# EAGLE design mmu610_v1.0b (EAGLE 4.15)
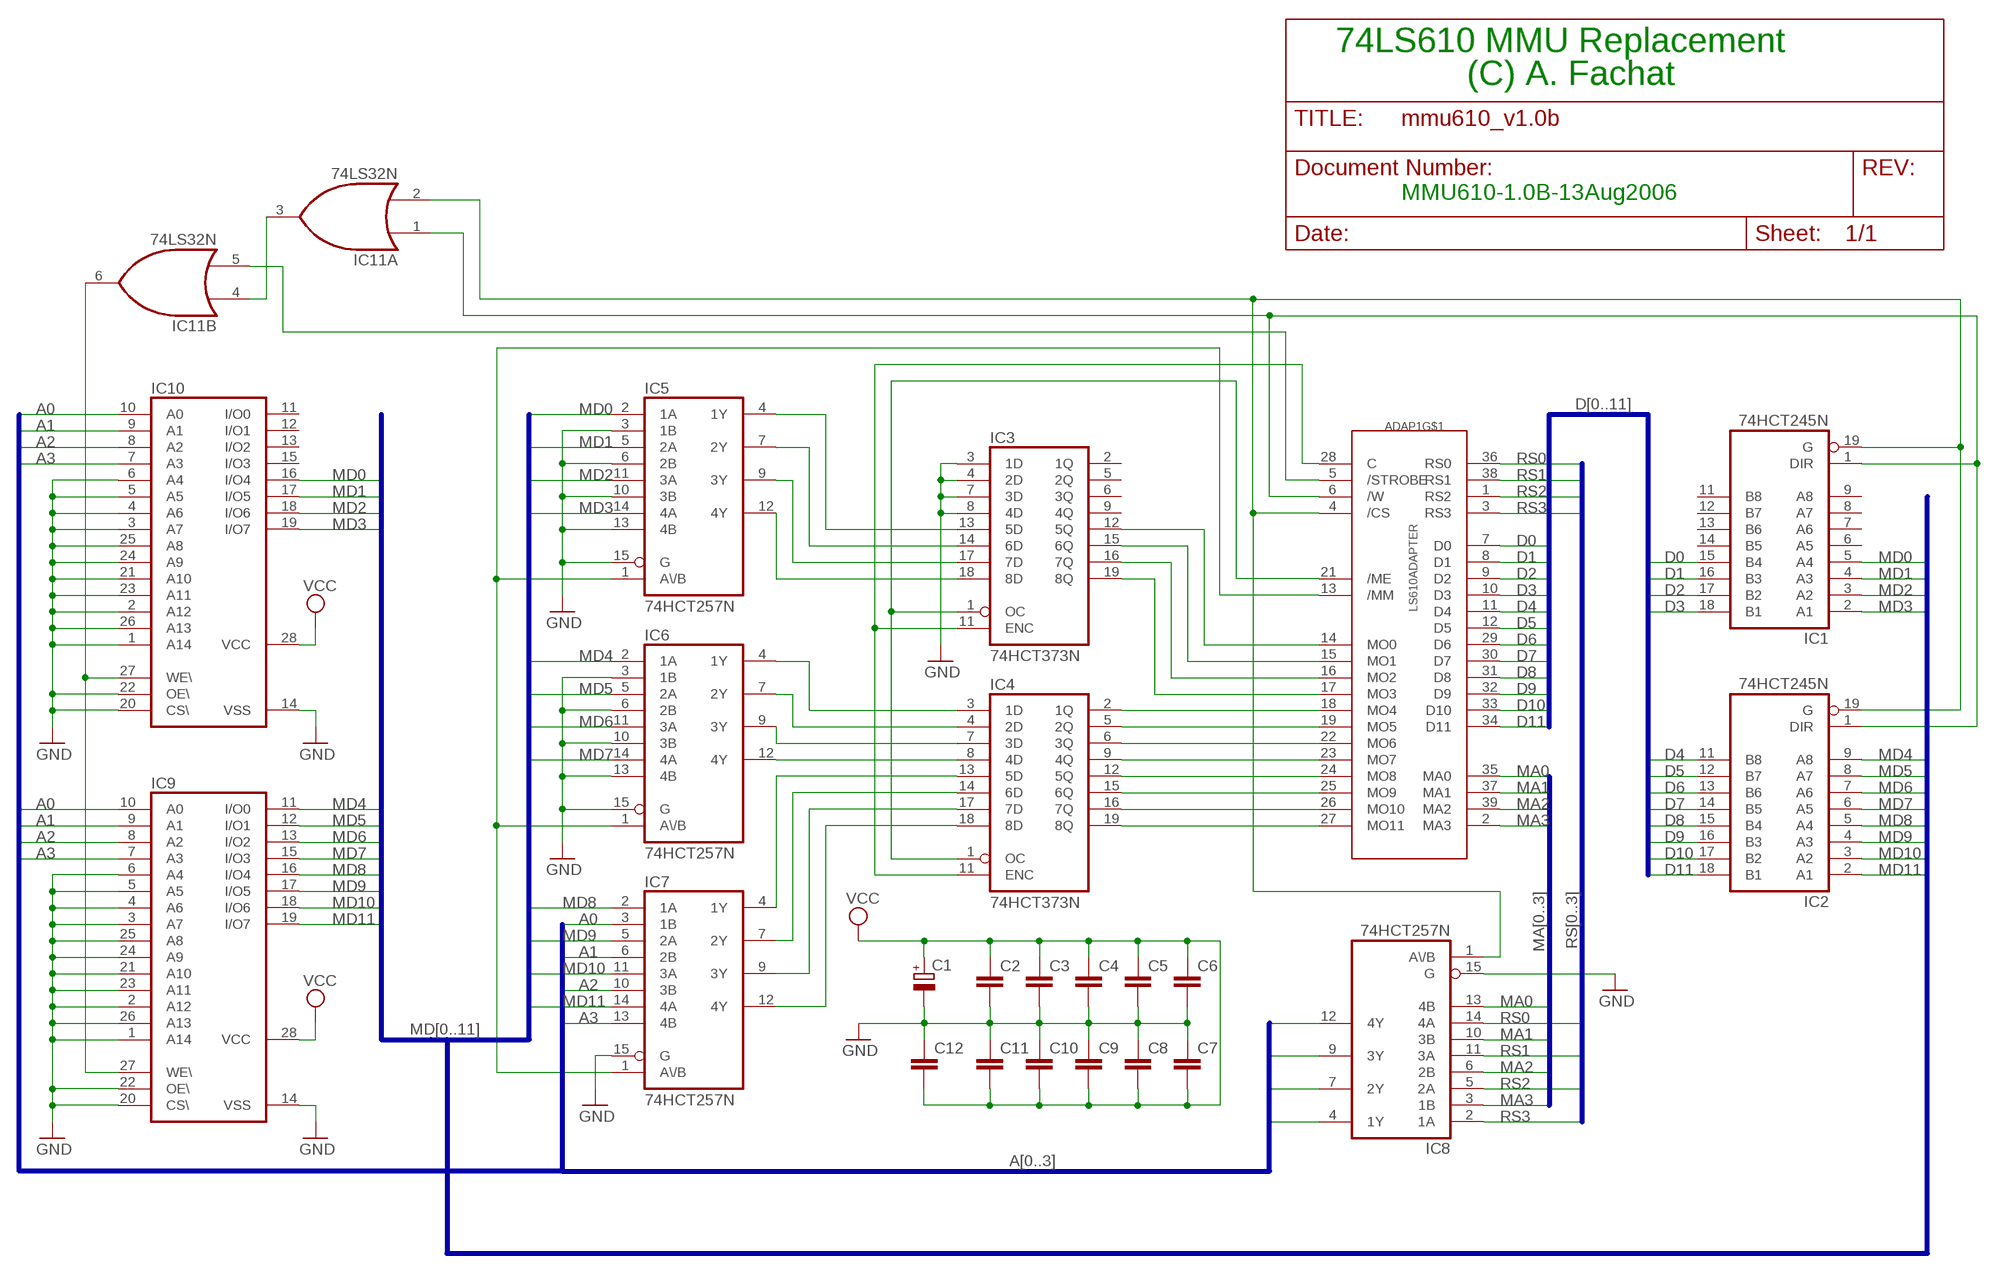
[diagram p0: schematic, sheet 1]

## Parts
ADAP1  LS610ADAPTER  [DIL40]
C1  CPOL-EUE2.5-6  [E2,5-6]
C2  C-EU025-025X050  [C025-025X050]
C3  C-EU025-025X050  [C025-025X050]
C4  C-EU025-025X050  [C025-025X050]
C5  C-EU025-025X050  [C025-025X050]
C6  C-EU025-025X050  [C025-025X050]
C7  C-EU025-025X050  [C025-025X050]
C8  C-EU025-025X050  [C025-025X050]
C9  C-EU025-025X050  [C025-025X050]
C10  C-EU025-025X050  [C025-025X050]
C11  C-EU025-025X050  [C025-025X050]
C12  C-EU025-025X050  [C025-025X050]
IC1  74HCT245N  [DIL20]
IC2  74HCT245N  [DIL20]
IC3  74HCT373N  [DIL20]
IC4  74HCT373N  [DIL20]
IC5  74HCT257N  [DIL16]
IC6  74HCT257N  [DIL16]
IC7  74HCT257N  [DIL16]
IC8  74HCT257N  [DIL16]
IC9  62832P  [DIL28-3]
IC10  62832P  [DIL28-3]
IC11  74LS32N  [DIL14]

## Nets
A0: IC7.3(1B) IC8.12(4Y) IC9.10(A0) IC10.10(A0)
A1: IC7.6(2B) IC8.9(3Y) IC9.9(A1) IC10.9(A1)
A2: IC7.10(3B) IC8.7(2Y) IC9.8(A2) IC10.8(A2)
A3: IC7.13(4B) IC8.4(1Y) IC9.7(A3) IC10.7(A3)
D0: ADAP1.7(D0) IC1.15(B4)
D1: ADAP1.8(D1) IC1.16(B3)
D2: ADAP1.9(D2) IC1.17(B2)
D3: ADAP1.10(D3) IC1.18(B1)
D4: ADAP1.11(D4) IC2.11(B8)
D5: ADAP1.12(D5) IC2.12(B7)
D6: ADAP1.29(D6) IC2.13(B6)
D7: ADAP1.30(D7) IC2.14(B5)
D8: ADAP1.31(D8) IC2.15(B4)
D9: ADAP1.32(D9) IC2.16(B3)
D10: ADAP1.33(D10) IC2.17(B2)
D11: ADAP1.34(D11) IC2.18(B1)
GND: C1.- C2.2 C3.2 C4.2 C5.2 C6.2 C7.1 C8.1 C9.1 C10.1 C11.1 C12.1 IC3.3(1D) IC3.4(2D) IC3.7(3D) IC3.8(4D) IC5.3(1B) IC5.6(2B) IC5.10(3B) IC5.13(4B) IC5.15(G) IC6.3(1B) IC6.6(2B) IC6.10(3B) IC6.13(4B) IC6.15(G) IC7.15(G) IC8.15(G) IC9.1(A14) IC9.2(A12) IC9.3(A7) IC9.4(A6) IC9.5(A5) IC9.6(A4) IC9.14(VSS) IC9.20(CS\) IC9.21(A10) IC9.22(OE\) IC9.23(A11) IC9.24(A9) IC9.25(A8) IC9.26(A13) IC10.1(A14) IC10.2(A12) IC10.3(A7) IC10.4(A6) IC10.5(A5) IC10.6(A4) IC10.14(VSS) IC10.20(CS\) IC10.21(A10) IC10.22(OE\) IC10.23(A11) IC10.24(A9) IC10.25(A8) IC10.26(A13)
MA0: ADAP1.35(MA0) IC8.13(4B)
MA1: ADAP1.37(MA1) IC8.10(3B)
MA2: ADAP1.39(MA2) IC8.6(2B)
MA3: ADAP1.2(MA3) IC8.3(1B)
MD0: IC1.5(A4) IC5.2(1A) IC10.16(I/O4)
MD1: IC1.4(A3) IC5.5(2A) IC10.17(I/O5)
MD2: IC1.3(A2) IC5.11(3A) IC10.18(I/O6)
MD3: IC1.2(A1) IC5.14(4A) IC10.19(I/O7)
MD4: IC2.9(A8) IC6.2(1A) IC9.11(I/O0)
MD5: IC2.8(A7) IC6.5(2A) IC9.12(I/O1)
MD6: IC2.7(A6) IC6.11(3A) IC9.13(I/O2)
MD7: IC2.6(A5) IC6.14(4A) IC9.15(I/O3)
MD8: IC2.5(A4) IC7.2(1A) IC9.16(I/O4)
MD9: IC2.4(A3) IC7.5(2A) IC9.17(I/O5)
MD10: IC2.3(A2) IC7.11(3A) IC9.18(I/O6)
MD11: IC2.2(A1) IC7.14(4A) IC9.19(I/O7)
N$9: ADAP1.27(MO11) IC4.19(8Q)
N$10: ADAP1.26(MO10) IC4.16(7Q)
N$11: ADAP1.25(MO9) IC4.15(6Q)
N$12: ADAP1.24(MO8) IC4.12(5Q)
N$13: ADAP1.23(MO7) IC4.9(4Q)
N$14: ADAP1.22(MO6) IC4.6(3Q)
N$15: ADAP1.19(MO5) IC4.5(2Q)
N$16: ADAP1.18(MO4) IC4.2(1Q)
N$17: ADAP1.17(MO3) IC3.19(8Q)
N$18: ADAP1.16(MO2) IC3.16(7Q)
N$19: ADAP1.15(MO1) IC3.15(6Q)
N$20: ADAP1.14(MO0) IC3.12(5Q)
N$21: IC3.18(8D) IC5.12(4Y)
N$22: IC3.17(7D) IC5.9(3Y)
N$23: IC3.14(6D) IC5.7(2Y)
N$24: IC3.13(5D) IC5.4(1Y)
N$25: IC4.8(4D) IC6.12(4Y)
N$26: IC4.7(3D) IC6.9(3Y)
N$27: IC4.4(2D) IC6.7(2Y)
N$28: IC4.3(1D) IC6.4(1Y)
N$29: IC4.13(5D) IC7.4(1Y)
N$30: IC4.14(6D) IC7.7(2Y)
N$31: IC4.17(7D) IC7.9(3Y)
N$32: IC4.18(8D) IC7.12(4Y)
N$34: ADAP1.5(/STROBE) IC11.5(B:I1)
N$35: ADAP1.6(/W) IC1.1(DIR) IC2.1(DIR) IC11.1(A:I0)
N$36: ADAP1.4(/CS) IC1.19(G) IC2.19(G) IC8.1(A\/B) IC11.2(A:I1)
N$38: ADAP1.13(/MM) IC5.1(A\/B) IC6.1(A\/B) IC7.1(A\/B)
N$39: IC11.3(A:O) IC11.4(B:I0)
N$40: IC9.27(WE\) IC10.27(WE\) IC11.6(B:O)
N$41: ADAP1.28(C) IC3.11(ENC) IC4.11(ENC)
N$42: ADAP1.21(/ME) IC3.1(OC) IC4.1(OC)
RS0: ADAP1.36(RS0) IC8.14(4A)
RS1: ADAP1.38(RS1) IC8.11(3A)
RS2: ADAP1.1(RS2) IC8.5(2A)
RS3: ADAP1.3(RS3) IC8.2(1A)
VCC: C1.+ C2.1 C3.1 C4.1 C5.1 C6.1 C7.2 C8.2 C9.2 C10.2 C11.2 C12.2 IC9.28(VCC) IC10.28(VCC)
Unconnected: IC1.6(A5) IC1.7(A6) IC1.8(A7) IC1.9(A8) IC1.11(B8) IC1.12(B7) IC1.13(B6) IC1.14(B5) IC3.2(1Q) IC3.5(2Q) IC3.6(3Q) IC3.9(4Q) IC10.11(I/O0) IC10.12(I/O1) IC10.13(I/O2) IC10.15(I/O3) IC11.8(C:O) IC11.9(C:I0) IC11.10(C:I1) IC11.11(D:O) IC11.12(D:I0) IC11.13(D:I1)

## Buses
MD[0..11]
A[0..3]
RS[0..3]
MA[0..3]
D[0..11]

## Notes on the sheet
- 74LS610 MMU Replacement
- (C) A. Fachat
- MMU610-1.0B-13Aug2006

## Power pins joined to a net without a drawn wire
GND: ADAP1.20(GND) IC1.10(GND) IC2.10(GND) IC3.10(GND) IC4.10(GND) IC5.8(GND) IC6.8(GND) IC7.8(GND) IC8.8(GND) IC11.7(P:GND)
VCC: ADAP1.40(VCC) IC1.20(VCC) IC2.20(VCC) IC3.20(VCC) IC4.20(VCC) IC5.16(VCC) IC6.16(VCC) IC7.16(VCC) IC8.16(VCC) IC11.14(P:VCC)

## Library data of the parts
ADAP1 = csa:LS610ADAPTER
C1 = rcl:CPOL-EU: POLARIZED CAPACITOR, European symbol
C2-C12 = rcl:C-EU: CAPACITOR, European symbol
IC1 IC2 = 74xx-eu:74*245: Octal BUS TRANSCEIVER, 3-state
IC3 IC4 = 74xx-eu:74*373: Octal D type transparent LATCH, edge triggered
IC5-IC8 = 74xx-eu:74*257: Quadruple 2-to 1 line data SELECTOR/MULTIPLEXER
IC9 IC10 = memory-hitachi:62832P: MEMORY
IC11 = 74xx-us:74*32: Quad 2-input OR gate

## Board
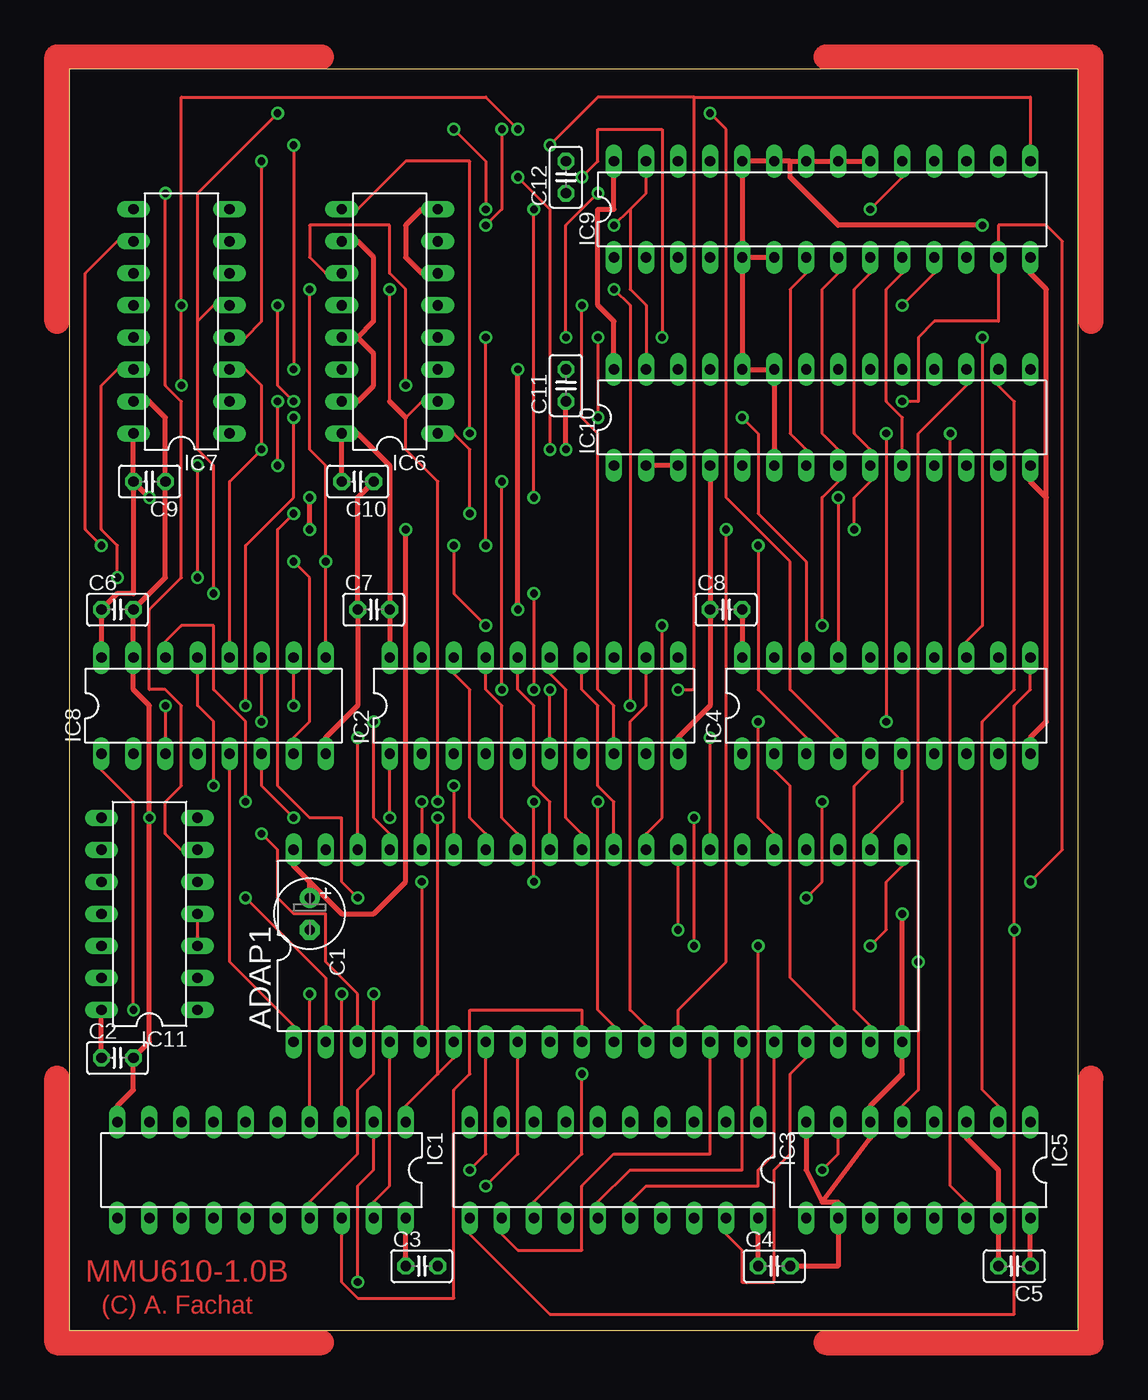
[diagram p1: board, top side]
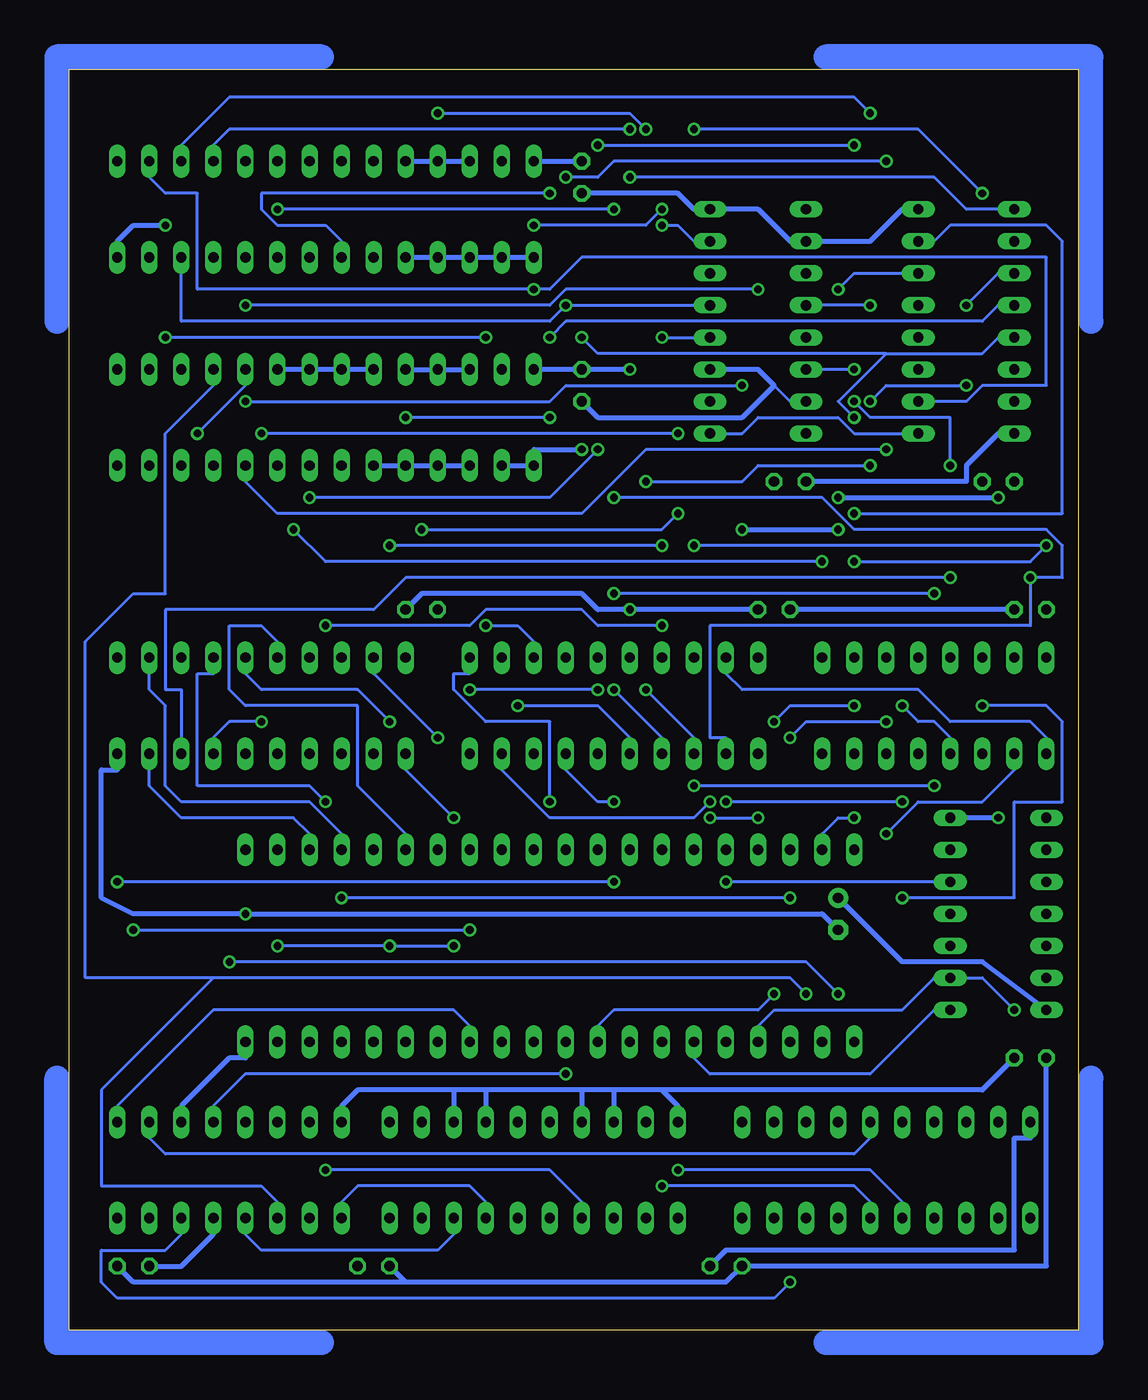
[diagram p2: board, bottom side, seen from below]

Size 80 x 100 mm. Coordinates in mm from the lower left corner, seen from the top.
Outline: 0,0 80,0 80,100 0,100 0,0
Copper layers (1*16): Top 0.035mm / dielectric 1.5mm / Bottom 0.035mm
Design rules "default": minimum track width 10mil, minimum drill 24mil, track to track 8mil, track to pad 8mil, pad to pad 8mil, via to via 8mil, smd to smd 8mil, copper to edge 40mil, drill to drill 8mil, minimum pad ring 10mil, minimum via ring 8mil, stop-mask expansion 4mil, vias tented up to drill 0mil, thermal gap 10mil

### Footprints (pad centres in the part's own frame; a part is rotated, then mirrored left to right if it is on the bottom)
DIL40 = drill 0.813 long: 1 -16.51,-7.62; 2 -13.97,-7.62; 3 -11.43,-7.62; 4 -8.89,-7.62; 5 -6.35,-7.62; 6 -3.81,-7.62; 7 -1.27,-7.62; 8 1.27,-7.62; 9 3.81,-7.62; 10 6.35,-7.62; 11 8.89,-7.62; 12 11.43,-7.62; 13 13.97,-7.62; 14 16.51,-7.62; 15 19.05,-7.62; 16 21.59,-7.62; 17 24.13,-7.62; 18 26.67,-7.62; 19 29.21,-7.62; 20 31.75,-7.62; 21 31.75,7.62; 22 29.21,7.62; 23 26.67,7.62; 24 24.13,7.62; 25 21.59,7.62; 26 19.05,7.62; 27 16.51,7.62; 28 13.97,7.62; 29 11.43,7.62; 30 8.89,7.62; 31 6.35,7.62; 32 3.81,7.62; 33 1.27,7.62; 34 -1.27,7.62; 35 -3.81,7.62; 36 -6.35,7.62; 37 -8.89,7.62; 38 -11.43,7.62; 39 -13.97,7.62; 40 -16.51,7.62
E2,5-6 = drill 0.813 pad 1.6 round: + -1.27,0 | drill 0.813 pad 1.6 octagon: - 1.27,0
C025-025X050 = drill 0.813 octagon: 1 -1.27,0; 2 1.27,0
DIL20 = drill 0.813 long: 1 -11.43,-3.81; 2 -8.89,-3.81; 3 -6.35,-3.81; 4 -3.81,-3.81; 5 -1.27,-3.81; 6 1.27,-3.81; 7 3.81,-3.81; 8 6.35,-3.81; 9 8.89,-3.81; 10 11.43,-3.81; 11 11.43,3.81; 12 8.89,3.81; 13 6.35,3.81; 14 3.81,3.81; 15 1.27,3.81; 16 -1.27,3.81; 17 -3.81,3.81; 18 -6.35,3.81; 19 -8.89,3.81; 20 -11.43,3.81
DIL16 = drill 0.813 long: 1 -8.89,-3.81; 2 -6.35,-3.81; 3 -3.81,-3.81; 4 -1.27,-3.81; 5 1.27,-3.81; 6 3.81,-3.81; 7 6.35,-3.81; 8 8.89,-3.81; 9 8.89,3.81; 10 6.35,3.81; 11 3.81,3.81; 12 1.27,3.81; 13 -1.27,3.81; 14 -3.81,3.81; 15 -6.35,3.81; 16 -8.89,3.81
DIL28-3 = drill 0.813 long: 1 -16.51,-3.81; 2 -13.97,-3.81; 3 -11.43,-3.81; 4 -8.89,-3.81; 5 -6.35,-3.81; 6 -3.81,-3.81; 7 -1.27,-3.81; 8 1.27,-3.81; 9 3.81,-3.81; 10 6.35,-3.81; 11 8.89,-3.81; 12 11.43,-3.81; 13 13.97,-3.81; 14 16.51,-3.81; 15 16.51,3.81; 16 13.97,3.81; 17 11.43,3.81; 18 8.89,3.81; 19 6.35,3.81; 20 3.81,3.81; 21 1.27,3.81; 22 -1.27,3.81; 23 -3.81,3.81; 24 -6.35,3.81; 25 -8.89,3.81; 26 -11.43,3.81; 27 -13.97,3.81; 28 -16.51,3.81
DIL14 = drill 0.813 long: 1 -7.62,-3.81; 2 -5.08,-3.81; 3 -2.54,-3.81; 4 0,-3.81; 5 2.54,-3.81; 6 5.08,-3.81; 7 7.62,-3.81; 8 7.62,3.81; 9 5.08,3.81; 10 2.54,3.81; 11 0,3.81; 12 -2.54,3.81; 13 -5.08,3.81; 14 -7.62,3.81

### Placement (x,y rotation side)
ADAP1  34.29,30.48 0 top
C1  19.05,33.02 270 top
C2  3.81,21.59 0 top
C3  27.94,5.08 0 top
C4  55.88,5.08 0 top
C5  74.93,5.08 180 top
C6  3.81,57.15 0 top
C7  24.13,57.15 0 top
C8  52.07,57.15 0 top
C9  6.35,67.31 180 top
C10  22.86,67.31 180 top
C11  39.37,74.93 90 top
C12  39.37,91.44 90 top
IC1  15.24,12.7 180 top
IC2  36.83,49.53 0 top
IC3  43.18,12.7 180 top
IC4  64.77,49.53 0 top
IC5  67.31,12.7 180 top
IC6  25.4,80.01 90 top
IC7  8.89,80.01 90 top
IC8  11.43,49.53 0 top
IC9  59.69,88.9 0 top
IC10  59.69,72.39 0 top
IC11  6.35,33.02 90 top

### Tracks (layer width: path | path; a pad name or v marks a point on that pad's centre or on a via)
A0  (via drill 0.61)
  Top 0.254: IC10.10 66.04,72.39 64.77,73.66 64.77,82.55 66.04,83.82 IC9.10 | IC8.12 12.7,67.31 v15.24,69.85 15.24,74.93 13.97,76.2 IC7.3
  Bottom 0.254: v15.24,69.85 34.29,69.85 39.37,64.77 63.5,64.77 66.04,67.31 IC10.10
A1  (via drill 0.61)
  Top 0.254: IC9.9 63.5,83.82 62.23,82.55 62.23,71.12 63.5,69.85 IC10.9 63.5,67.31 62.23,66.04 v62.23,63.5 | v19.05,82.55 19.05,69.85 20.32,68.58 v20.32,60.96 IC8.9
  Bottom 0.254: v19.05,82.55 17.78,83.82 IC7.6 | v62.23,63.5 59.69,60.96 v20.32,60.96
A2  (via drill 0.61)
  Top 0.254: IC9.8 60.96,83.82 59.69,82.55 59.69,71.12 60.96,69.85 IC10.8 60.96,67.31 59.69,66.04 v59.69,55.88 | v2.54,62.23 1.27,63.5 1.27,83.82 3.81,86.36 IC7.10 | v17.78,60.96 19.05,59.69 19.05,48.26 17.78,46.99 IC8.7 | v33.02,55.88 30.48,58.42 v30.48,62.23
  Bottom 0.254: v17.78,60.96 3.81,60.96 v2.54,62.23 v30.48,62.23 | v59.69,55.88 48.26,55.88 46.99,57.15 39.37,57.15 38.1,55.88 v33.02,55.88
A3  (via drill 0.61)
  Top 0.254: IC10.7 58.42,69.85 57.15,71.12 57.15,82.55 58.42,83.82 IC9.7 | v17.78,72.39 17.78,66.04 13.97,62.23 v13.97,49.53 | v41.91,90.17 39.37,87.63 v39.37,78.74
  Bottom 0.254: 15.24,77.47 7.62,77.47 6.35,78.74 IC7.13 | 15.24,77.47 19.05,73.66 v17.78,72.39 | v13.97,49.53 12.7,48.26 11.43,48.26 10.16,46.99 IC8.4 | v41.91,90.17 64.77,90.17 64.77,88.9 63.5,87.63 59.69,87.63 58.42,86.36 IC9.7 | v39.37,78.74 38.1,77.47 15.24,77.47
D0  (via drill 0.61)
  Top 0.254: v31.75,12.7 33.02,13.97 ADAP1.7
  Bottom 0.254: v31.75,12.7 16.51,12.7 13.97,10.16 IC1.15
D1  (via drill 0.61)
  Top 0.254: v33.02,11.43 35.56,13.97 ADAP1.8
  Bottom 0.254: v33.02,11.43 17.78,11.43 16.51,10.16 IC1.16
D2  (via drill 0.61)
  Top 0.254: v24.13,26.67 24.13,20.32 22.86,19.05 22.86,13.97 19.05,10.16 IC1.17
  Bottom 0.254: v24.13,26.67 25.4,25.4 36.83,25.4 38.1,24.13 ADAP1.9
D3
  Top 0.254: IC1.18 21.59,3.81 22.86,2.54 30.48,2.54 30.48,19.05 31.75,20.32 31.75,25.4 40.64,25.4 ADAP1.10
D4  (via drill 0.61)
  Top 0.254: v41.91,41.91 41.91,25.4 43.18,24.13 ADAP1.11
  Bottom 0.254: v41.91,41.91 41.91,48.26 46.99,48.26 49.53,50.8 49.53,52.07 48.26,52.07 IC2.11
D5
  Top 0.254: ADAP1.12 45.72,24.13 44.45,25.4 44.45,48.26 45.72,49.53 IC2.12
D6  (via drill 0.61)
  Top 0.254: v46.99,55.88 46.99,40.64 45.72,39.37 ADAP1.29
  Bottom 0.254: v46.99,55.88 44.45,55.88 43.18,54.61 IC2.13
D7
  Top 0.254: ADAP1.30 43.18,41.91 41.91,43.18 41.91,49.53 40.64,50.8 IC2.14
D8
  Top 0.254: ADAP1.31 40.64,39.37 39.37,40.64 39.37,50.8 38.1,52.07 IC2.15
D9
  Top 0.254: ADAP1.32 38.1,41.91 36.83,43.18 36.83,49.53 35.56,50.8 IC2.16
D10
  Top 0.254: ADAP1.33 35.56,39.37 34.29,40.64 34.29,49.53 33.02,50.8 IC2.17
D11
  Top 0.254: ADAP1.34 33.02,39.37 31.75,40.64 31.75,50.8 30.48,52.07 IC2.18
GND  (via drill 0.61)
  Top 0.254: IC6.8 27.94,88.9
  Top 0.406: 22.86,78.74 24.13,77.47 24.13,74.93 22.86,73.66 IC6.15 | 27.94,88.9 26.67,87.63 26.67,85.09 27.94,83.82 IC6.6 | 22.86,78.74 24.13,80.01 24.13,85.09 22.86,86.36 IC6.10 | 22.86,78.74 IC6.13 | IC9.5 IC9.6 | 57.15,92.71 IC9.23 IC9.24 IC9.5 | 57.15,92.71 IC9.22 IC9.21 IC9.20 | IC2.10 48.26,46.99 50.8,49.53 C8.1 IC10.4 | IC10.3 IC10.2 | IC10.6 IC10.23 IC10.24 IC9.5 | v39.37,69.85 C11.1 | IC1.10 3.81,17.78 5.08,19.05 C2.2 6.35,22.86 v6.35,40.64 6.35,49.53 5.08,50.8 IC8.15 C6.2 7.62,59.69 C9.1 7.62,72.39 6.35,73.66 IC7.15 | IC8.8 20.32,46.99 22.86,49.53 C7.1 22.86,66.04 C10.1 | IC5.3 71.12,15.24 73.66,12.7 IC5.15 C5.2 | C4.2 60.96,5.08 IC5.10 60.96,10.16 59.69,10.16 | 59.69,10.16 58.42,12.7 IC5.8 | 59.69,10.16 63.5,15.24 IC5.6 63.5,17.78 66.04,20.32 ADAP1.20 v66.04,33.02 | 77.47,66.04 77.47,48.26 76.2,46.99 IC4.10 | 77.47,66.04 76.2,67.31 IC10.14 | 77.47,66.04 77.47,82.55 76.2,83.82 IC9.14 | 57.15,92.71 57.15,91.44 60.96,87.63 v72.39,87.63
  Bottom 0.254: 24.13,74.93 22.86,73.66 IC6.15 | IC6.10 22.86,86.36 | 3.81,15.24 IC1.10 | 71.12,17.78 IC5.3 | ADAP1.20 66.04,21.59
  Bottom 0.406: IC6.3 25.4,76.2 24.13,74.93 26.67,72.39 38.1,72.39 C11.1 | 22.86,86.36 25.4,88.9 IC6.8 30.48,88.9 31.75,90.17 C12.1 | IC7.8 13.97,88.9 16.51,86.36 IC6.10 | IC9.1 IC9.2 IC9.3 IC9.4 IC9.5 | IC9.26 IC9.25 IC9.24 | IC10.2 IC10.1 43.18,69.85 v39.37,69.85 | IC10.3 IC10.4 IC10.5 IC10.6 | IC10.26 IC10.25 IC10.24 | IC10.23 IC10.22 IC10.21 IC10.20 | C3.2 27.94,6.35 5.08,6.35 5.08,15.24 3.81,15.24 | v6.35,40.64 IC11.7 | C6.2 C7.1 | C5.2 71.12,5.08 68.58,7.62 IC5.13 | 33.02,19.05 31.75,17.78 IC3.10 | 33.02,19.05 36.83,19.05 | 36.83,19.05 39.37,19.05 | 39.37,19.05 46.99,19.05 | 46.99,19.05 49.53,19.05 | 49.53,19.05 57.15,19.05 58.42,17.78 IC5.8 | 71.12,17.78 67.31,21.59 66.04,21.59 | C1.- 20.32,33.02 v66.04,33.02 74.93,33.02 77.47,34.29 77.47,44.45 76.2,44.45 IC4.10 | C2.2 7.62,19.05 33.02,19.05 | v72.39,87.63 74.93,87.63 76.2,86.36 IC9.14 | 36.83,19.05 IC3.8 | 39.37,19.05 IC3.7 | 46.99,19.05 IC3.4 | 49.53,19.05 IC3.3
MA0  (via drill 0.61)
  Top 0.254: v11.43,43.18 11.43,48.26 10.16,49.53 IC8.13 | v30.48,43.18 ADAP1.35
  Bottom 0.254: v11.43,43.18 v30.48,43.18
MA1  (via drill 0.61)
  Top 0.254: v24.13,48.26 24.13,40.64 25.4,39.37 ADAP1.37 | v17.78,49.53 IC8.10
  Bottom 0.254: v24.13,48.26 22.86,49.53 v17.78,49.53
MA2  (via drill 0.61)
  Top 0.254: v17.78,40.64 15.24,43.18 IC8.6
  Bottom 0.254: v17.78,40.64 19.05,40.64 20.32,39.37 ADAP1.39
MA3  (via drill 0.61)
  Top 0.254: v13.97,34.29 20.32,27.94 ADAP1.2 | v7.62,49.53 IC8.3
  Bottom 0.254: v7.62,49.53 2.54,49.53 1.27,48.26 1.27,41.91 5.08,41.91 5.08,34.29 v13.97,34.29
MD0
  Top 0.254: IC10.16 73.66,74.93 74.93,73.66 74.93,50.8 72.39,48.26 72.39,19.05 73.66,17.78 IC5.2
  Bottom 0.254: IC1.5 16.51,15.24 17.78,13.97 72.39,13.97 73.66,15.24 IC5.2
MD1  (via drill 0.61)
  Top 0.254: IC1.4 v19.05,26.67 | IC5.5 66.04,17.78 67.31,19.05 v67.31,29.21 67.31,71.12 71.12,74.93 IC10.17
  Bottom 0.254: v19.05,26.67 21.59,29.21 v67.31,29.21
MD2  (via drill 0.61)
  Top 0.254: IC1.3 v21.59,26.67
  Bottom 0.254: v21.59,26.67 22.86,27.94 68.58,27.94 | 68.58,27.94 77.47,19.05 77.47,11.43 64.77,11.43 63.5,10.16 IC5.11 | 68.58,27.94 78.74,27.94 78.74,54.61 74.93,58.42 72.39,58.42 72.39,71.12 68.58,74.93 IC10.18
MD3  (via drill 0.61)
  Top 0.254: v22.86,3.81 22.86,11.43 24.13,12.7 IC1.2 | v69.85,71.12 69.85,11.43 71.12,10.16 IC5.14
  Bottom 0.254: v22.86,3.81 24.13,2.54 76.2,2.54 77.47,3.81 77.47,6.35 72.39,6.35 71.12,7.62 IC5.14 | v69.85,71.12 66.04,74.93 IC10.19
MD4  (via drill 0.61)
  Top 0.254: v29.21,41.91 29.21,67.31 26.67,69.85 26.67,72.39 27.94,73.66 IC6.2 | v66.04,81.28 68.58,83.82 IC9.11 | 25.4,73.66 v25.4,82.55
  Top 0.406: 26.67,72.39 25.4,73.66
  Bottom 0.254: v29.21,41.91 30.48,40.64 41.91,40.64 45.72,44.45 IC2.9 | v66.04,81.28 41.91,81.28 40.64,82.55 v25.4,82.55
MD5  (via drill 0.61)
  Top 0.254: v40.64,81.28 40.64,72.39 41.91,71.12 41.91,50.8 43.18,49.53 IC2.8
  Bottom 0.254: IC6.5 v40.64,81.28 41.91,80.01 71.12,80.01 IC9.12
MD6  (via drill 0.61)
  Top 0.254: v36.83,35.56 v36.83,41.91 | v76.2,35.56 78.74,38.1 78.74,86.36 77.47,87.63 73.66,87.63 IC9.13 73.66,80.01 68.58,80.01 67.31,78.74 67.31,73.66 v66.04,73.66 | v26.67,74.93 26.67,82.55 25.4,83.82 25.4,87.63 19.05,87.63 19.05,85.09 20.32,83.82 IC6.11
  Bottom 0.254: v36.83,41.91 38.1,41.91 40.64,44.45 IC2.7 | v36.83,35.56 v76.2,35.56 | v26.67,74.93 40.64,74.93 41.91,73.66 v66.04,73.66
MD7  (via drill 0.61)
  Top 0.254: v17.78,93.98 v17.78,76.2 | v38.1,93.98 41.91,97.79 49.53,97.79 | 49.53,97.79 76.2,97.79 IC9.15 | v48.26,50.8 49.53,50.8 49.53,97.79 | IC2.6 v38.1,50.8
  Bottom 0.254: v38.1,93.98 v17.78,93.98 | v17.78,76.2 IC6.14 | v38.1,50.8 v48.26,50.8
MD8  (via drill 0.61)
  Top 0.254: v44.45,49.53 44.45,81.28 v43.18,82.55
  Bottom 0.254: IC7.2 8.89,73.66 7.62,74.93 2.54,74.93 2.54,85.09 39.37,85.09 41.91,82.55 v43.18,82.55 69.85,82.55 69.85,90.17 72.39,90.17 73.66,91.44 IC9.16 | v44.45,49.53 38.1,49.53 35.56,46.99 IC2.5
MD9  (via drill 0.61)
  Top 0.254: v36.83,58.42 v36.83,50.8 | v11.43,58.42 11.43,68.58 10.16,69.85 10.16,80.01 | 10.16,80.01 11.43,81.28 IC7.5 | v16.51,96.52 10.16,90.17 10.16,80.01
  Bottom 0.254: v36.83,50.8 33.02,46.99 IC2.4 | v11.43,58.42 v36.83,58.42 | v16.51,96.52 17.78,97.79 67.31,97.79 71.12,93.98 IC9.17
MD10  (via drill 0.61)
  Top 0.254: v34.29,50.8 v34.29,67.31 | v16.51,68.58 v16.51,73.66 | v8.89,74.93 v8.89,81.28 8.89,97.79 33.02,97.79 v35.56,95.25
  Bottom 0.254: v34.29,50.8 30.48,46.99 IC2.3 | v34.29,67.31 26.67,67.31 25.4,68.58 v16.51,68.58 | v16.51,73.66 15.24,74.93 v8.89,74.93 | v8.89,81.28 6.35,83.82 IC7.11 | v35.56,95.25 67.31,95.25 68.58,93.98 IC9.18
MD11  (via drill 0.61)
  Top 0.254: v3.81,59.69 3.81,62.23 2.54,63.5 2.54,74.93 3.81,76.2 IC7.14 | v63.5,88.9 66.04,91.44 IC9.19 | v36.83,66.04 v36.83,88.9
  Bottom 0.254: IC2.2 27.94,46.99 29.21,46.99 29.21,55.88 3.81,55.88 v3.81,59.69 1.27,59.69 1.27,62.23 2.54,63.5 17.78,63.5 20.32,66.04 v36.83,66.04 | v36.83,88.9 v63.5,88.9
N$1
  Top 2: 20,-1 -1,-1 -1,20
N$2
  Top 2: 60,-1 81,-1 81,20
N$3
  Top 2: 20,101 -1,101 -1,80
N$4
  Top 2: 81,80 81,101 60,101
N$5
  Bottom 2: 20,-1 -1,-1 -1,20
N$6
  Bottom 2: 60,-1 81,-1 81,20
N$7
  Bottom 2: 20,101 -1,101 -1,80
N$8
  Bottom 2: 81,80 81,101 60,101
N$9  (via drill 0.61)
  Top 0.254: ADAP1.27 v50.8,46.99
  Bottom 0.254: v50.8,46.99 55.88,52.07 IC4.19
N$10
  Bottom 0.254: ADAP1.26 53.34,39.37 57.15,43.18 57.15,49.53 66.04,49.53 67.31,50.8 67.31,55.88 64.77,55.88 63.5,54.61 IC4.16
N$11  (via drill 0.61)
  Top 0.254: v54.61,48.26 54.61,40.64 55.88,39.37 ADAP1.25
  Bottom 0.254: v54.61,48.26 57.15,50.8 64.77,50.8 66.04,52.07 IC4.15
N$12
  Bottom 0.254: ADAP1.24 58.42,39.37 60.96,41.91 71.12,41.91 72.39,43.18 72.39,49.53 73.66,50.8 IC4.12
N$13
  Bottom 0.254: ADAP1.23 60.96,39.37 62.23,40.64 71.12,40.64 73.66,43.18 IC4.9
N$14
  Top 0.254: ADAP1.22 63.5,39.37 66.04,41.91 IC4.6
N$15
  Top 0.254: ADAP1.19 63.5,24.13 62.23,25.4 62.23,43.18 63.5,44.45 IC4.5
N$16
  Top 0.254: ADAP1.18 60.96,24.13 57.15,27.94 57.15,43.18 55.88,44.45 IC4.2
N$17
  Top 0.254: IC3.19 52.07,7.62 53.34,6.35 53.34,3.81 55.88,3.81 55.88,12.7 57.15,13.97 57.15,20.32 58.42,21.59 ADAP1.17
N$18
  Top 0.254: IC3.16 44.45,10.16 45.72,11.43 54.61,11.43 54.61,12.7 55.88,13.97 ADAP1.16
N$19
  Top 0.254: IC3.15 41.91,10.16 44.45,12.7 53.34,12.7 ADAP1.15
N$20
  Top 0.254: IC3.12 34.29,7.62 35.56,6.35 40.64,6.35 40.64,11.43 43.18,13.97 50.8,13.97 ADAP1.14
N$21
  Bottom 0.254: IC3.18 49.53,7.62 50.8,6.35 64.77,6.35 66.04,7.62 IC5.12
N$22
  Bottom 0.254: IC3.17 46.99,10.16 48.26,11.43 57.15,11.43 58.42,10.16 IC5.9
N$23  (via drill 0.61)
  Top 0.254: v59.69,12.7 60.96,13.97 IC5.7
  Bottom 0.254: v59.69,12.7 41.91,12.7 39.37,10.16 IC3.14
N$24  (via drill 0.61)
  Top 0.254: v40.64,20.32 40.64,13.97 36.83,10.16 IC3.13
  Bottom 0.254: v40.64,20.32 66.04,20.32 68.58,17.78 IC5.4
N$25  (via drill 0.61)
  Top 0.254: v10.16,59.69 v10.16,68.58 | v17.78,73.66 16.51,74.93 v16.51,81.28
  Bottom 0.254: v10.16,59.69 53.34,59.69 55.88,57.15 72.39,57.15 72.39,50.8 71.12,50.8 IC4.8 | v10.16,68.58 10.16,72.39 16.51,72.39 v17.78,73.66 | v16.51,81.28 IC6.12
N$26  (via drill 0.61)
  Top 0.254: v31.75,71.12 31.75,92.71 26.67,92.71 22.86,88.9 IC6.9 | v64.77,71.12 v64.77,48.26
  Bottom 0.254: v31.75,71.12 v64.77,71.12 | v64.77,48.26 67.31,48.26 68.58,46.99 IC4.7
N$27  (via drill 0.61)
  Top 0.254: v33.02,87.63 34.29,88.9 v34.29,95.25 | v50.8,96.52 52.07,95.25 52.07,66.04 57.15,60.96 57.15,50.8 60.96,46.99 IC4.4
  Bottom 0.254: v33.02,87.63 31.75,87.63 30.48,86.36 IC6.7 | v34.29,95.25 35.56,96.52 v50.8,96.52
N$28  (via drill 0.61)
  Top 0.254: v54.61,62.23 54.61,50.8 58.42,46.99 IC4.3 | v33.02,62.23 v33.02,78.74
  Bottom 0.254: v33.02,62.23 v54.61,62.23 | v33.02,78.74 IC6.4
N$29  (via drill 0.61)
  Top 0.254: v15.24,92.71 15.24,80.01 13.97,78.74 IC7.4 | v40.64,91.44 41.91,92.71 41.91,95.25 46.99,95.25 v46.99,78.74 | v72.39,78.74 72.39,55.88 71.12,54.61 IC4.13
  Bottom 0.254: v15.24,92.71 36.83,92.71 38.1,91.44 v40.64,91.44 | v46.99,78.74 v72.39,78.74
N$30  (via drill 0.61)
  Top 0.254: v17.78,64.77 16.51,63.5 16.51,43.18 19.05,40.64 21.59,40.64 21.59,35.56 v22.86,34.29 | v58.42,34.29 59.69,35.56 v59.69,41.91
  Bottom 0.254: v17.78,64.77 1.27,64.77 1.27,86.36 2.54,87.63 10.16,87.63 11.43,86.36 IC7.7 | v22.86,34.29 v58.42,34.29 | v59.69,41.91 60.96,43.18 69.85,43.18 69.85,52.07 68.58,52.07 IC4.14
N$31  (via drill 0.61)
  Top 0.254: v35.56,91.44 38.1,88.9 v38.1,69.85 | v60.96,66.04 IC4.17
  Bottom 0.254: v35.56,91.44 11.43,91.44 8.89,88.9 IC7.9 | v38.1,69.85 41.91,66.04 v60.96,66.04
N$32  (via drill 0.61)
  Top 0.254: v41.91,78.74 v41.91,72.39 | v53.34,72.39 54.61,71.12 54.61,64.77 58.42,60.96 IC4.18
  Bottom 0.254: v41.91,78.74 40.64,80.01 7.62,80.01 6.35,81.28 IC7.12 | v41.91,72.39 v53.34,72.39
N$34  (via drill 0.61)
  Top 0.254: v27.94,35.56 ADAP1.5
  Bottom 0.254: IC11.5 v27.94,35.56
N$35  (via drill 0.61)
  Top 0.254: 29.21,20.32 30.48,21.59 ADAP1.6 | 29.21,20.32 26.67,17.78 IC1.1 | 29.21,20.32 v29.21,40.64 | v25.4,40.64 IC2.1
  Bottom 0.254: IC11.1 11.43,25.4 16.51,20.32 29.21,20.32 30.48,21.59 ADAP1.6 | v29.21,40.64 v25.4,40.64
N$36  (via drill 0.61)
  Top 0.254: IC1.19 24.13,10.16 25.4,11.43 ADAP1.4 | v5.08,25.4 5.08,41.91 2.54,44.45 IC8.1
  Bottom 0.254: IC8.1 2.54,46.99 3.81,48.26 10.16,48.26 12.7,50.8 26.67,50.8 27.94,52.07 IC2.19 | ADAP1.4 25.4,24.13 24.13,25.4 13.97,25.4 11.43,27.94 IC11.2 7.62,27.94 v5.08,25.4
N$38  (via drill 0.61)
  Top 0.254: v31.75,64.77 31.75,69.85 30.48,71.12 IC6.1 | v52.07,63.5 52.07,29.21 48.26,25.4 ADAP1.13
  Bottom 0.254: IC7.1 17.78,71.12 19.05,72.39 25.4,72.39 26.67,71.12 IC6.1 | ADAP1.13 48.26,24.13 49.53,25.4 68.58,25.4 76.2,17.78 IC5.1 | v31.75,64.77 33.02,63.5 v52.07,63.5
N$39
  Top 0.254: IC11.3 IC11.4
N$40  (via drill 0.61)
  Top 0.254: v7.62,90.17 7.62,74.93 8.89,73.66 8.89,59.69 6.35,57.15 6.35,50.8 7.62,50.8 8.89,49.53 8.89,43.18 7.62,41.91 7.62,39.37 8.89,38.1 IC11.6 | v30.48,95.25 33.02,92.71 v33.02,88.9 | 44.45,88.9 45.72,90.17 IC9.27 | v43.18,87.63 44.45,88.9 | 44.45,88.9 44.45,82.55 45.72,81.28 IC10.27
  Bottom 0.254: v7.62,90.17 12.7,95.25 v30.48,95.25 | v33.02,88.9 34.29,87.63 v43.18,87.63
N$41  (via drill 0.61)
  Top 0.254: IC3.11 31.75,7.62 38.1,1.27 74.93,1.27 v74.93,31.75 74.93,49.53 76.2,50.8 IC4.11 | v48.26,31.75 ADAP1.28
  Bottom 0.254: v74.93,31.75 v48.26,31.75
N$42  (via drill 0.61)
  Top 0.254: v63.5,30.48 64.77,31.75 64.77,35.56 66.04,36.83 ADAP1.21 | IC3.1 v54.61,30.48 | v49.53,30.48 v49.53,40.64
  Bottom 0.254: v63.5,30.48 v54.61,30.48 v49.53,30.48 | v49.53,40.64 53.34,44.45 IC4.1
RS0  (via drill 0.61)
  Top 0.254: v13.97,41.91 13.97,48.26 11.43,50.8 11.43,55.88 8.89,55.88 7.62,54.61 IC8.14 | v27.94,41.91 ADAP1.36
  Bottom 0.254: v13.97,41.91 v27.94,41.91
RS1  (via drill 0.61)
  Top 0.254: ADAP1.38 v22.86,46.99 | v15.24,48.26 IC8.11
  Bottom 0.254: v22.86,46.99 21.59,48.26 v15.24,48.26
RS2
  Top 0.254: ADAP1.1 17.78,24.13 12.7,29.21 IC8.5
RS3  (via drill 0.61)
  Top 0.254: v15.24,39.37 16.51,38.1 16.51,34.29 17.78,33.02 20.32,33.02 20.32,29.21 22.86,26.67 ADAP1.3
  Bottom 0.254: v15.24,39.37 12.7,41.91 7.62,41.91 5.08,44.45 IC8.2
VCC  (via drill 0.61)
  Top 0.406: IC10.28 43.18,80.01 41.91,81.28 41.91,88.9 43.18,88.9 IC9.28 | IC8.16 C6.1 3.81,58.42 5.08,58.42 C9.2 | C9.2 IC7.16 | C8.2 IC4.20 | IC2.20 C7.2 25.4,68.58 22.86,71.12 IC6.16 C10.2 | v35.56,57.15 v35.56,76.2 | C2.1 IC11.14 | 19.05,35.56 17.78,36.83 ADAP1.40 | C1.+ 19.05,35.56 | C5.1 IC5.16 | C3.1 IC1.20 | C4.1 IC3.20 | v6.35,66.04 C9.2 | v19.05,63.5 v19.05,66.04 | v26.67,63.5 26.67,35.56 24.13,33.02 21.59,33.02 19.05,35.56
  Bottom 0.254: IC7.16 6.35,71.12
  Bottom 0.406: IC10.28 C11.2 v35.56,76.2 | IC9.28 C12.2 | C8.2 52.07,58.42 39.37,58.42 38.1,57.15 v35.56,57.15 C7.2 | 6.35,71.12 8.89,68.58 8.89,67.31 C10.2 | IC11.14 7.62,29.21 13.97,29.21 C1.+ | 53.34,3.81 27.94,3.81 C3.1 2.54,5.08 C2.1 | 53.34,3.81 C4.1 | C5.1 74.93,3.81 53.34,3.81 | v19.05,66.04 v6.35,66.04 | v26.67,63.5 v19.05,63.5

### Text on the board
Top: MMU610-1.0B | (C) A. Fachat